# EAGLE schematic low-voltage-cutoff (EAGLE 9.6.1)
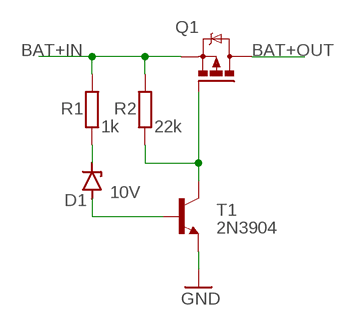
[diagram p0: schematic, sheet 1]

## Parts
D1  10V  1N4728  [DO41Z10]
Q1  IRFU5305  [I-PAK_TO251AA]
R1  1k  R-EU_0207/10  [0207/10]
R2  22k  R-EU_0207/10  [0207/10]
T1  2N3904  [TO92]

## Nets
BAT+IN: Q1.3(S) R1.2 R2.2
BAT+OUT: Q1.2(D)
GND: T1.3(E)
N$1: D1.C R1.1
N$2: Q1.1(G) R2.1 T1.1(C)
N$3: D1.A T1.2(B)

## Notes on the sheet
- 10V

## Library data of the parts
D1 = diode:1N4728: Z DIODE 3.3 V, 1W, 5 percent
Q1 = transistor-power:IRF?5305: HEXFET Power MOSFET Source: http://www.irf.com/product-info/datasheets/data/irfr5305pbf.pdf
R1 R2 = rcl:R-EU_: RESISTOR, European symbol; SPICEPREFIX: R
T1 = transistor:2N3904: NPN TRANSISTOR